# Altium schematic sheet 3V3_REG.SchDoc
size A4; SheetNumber: 2; SheetTotal: 3
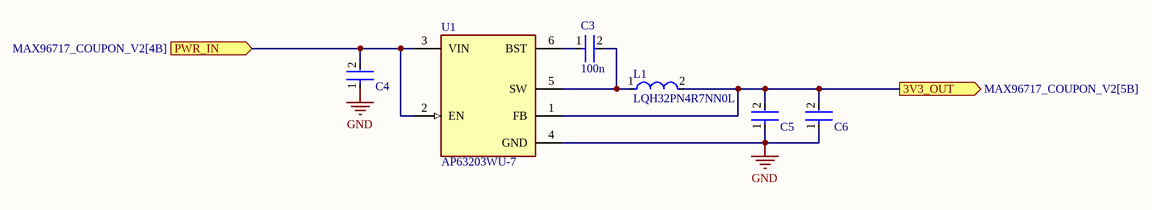
[diagram p0: 3V3_REG.SchDoc]

## Parts
C3  100n  [FP-0402-L_1_0_0_05-W_0_5-IPC_A]
C4  GRM21BR61E226ME44L  [FP-GRM21B-0_2-e0_2_0_7-IPC_B]  (value not drawn)
C5  GRM21BR61E226ME44L  [FP-GRM21B-0_2-e0_2_0_7-IPC_B]  (value not drawn)
C6  GRM21BR61E226ME44L  [FP-GRM21B-0_2-e0_2_0_7-IPC_B]  (value not drawn)
L1  LQH32PN4R7NN0L  [FP-LQH32PB_N0-MFG]
U1  AP63203WU-7  [FP-TSOT26-MFG]

## Ports
3V3_OUT (out, see MAX96717_COUPON_V2[5B]), PWR_IN (in, see MAX96717_COUPON_V2[4B])

## Nets
GND: C4.1 C5.1 C6.1 U1.4(GND)
3V3_OUT: C5.2 C6.2 L1.2 U1.1(FB) ; port 3V3_OUT
PWR_IN: C4.2 U1.2(EN) U1.3(VIN) ; port PWR_IN
NetC3_1: C3.1 U1.6(BST)
NetC3_2: C3.2 L1.1 U1.5(SW)

## Library data of the parts
C3 = CMP-001-00058-1: LARGE PADS, 0402 CAP, CHANGE COMMENT TO MATCH REAL P/N; Capacitor Type: Ceramic; Min Operating Temperature: -55°C; Mounting Technology: Surface Mount; Pins: 2; Case/Package: 0402; RoHS Compliant: Yes; Max Operating Temperature: 85°C
C4-C6 = CMP-2007-03222-3: Chip Multilayer Ceramic Capacitors for General Purpose, 0805, 22uF, X5R, 15%, 20%, 25V; Case/Package: 0805; Depth: 1.25mm; Resistor Type: Ceramic; Voltage Rating: 25V; Lead Free: Lead Free; Voltage Rating (DC): 25V; Case Code (Metric): 2012; Thickness: 0.057inch; REACH SVHC: No SVHC; Material: Ceramic; Tolerance: 20%; Length: 2mm; Capacitance: 22uF; Case Code (Imperial): 0805; Max Operating Temperature: 85°C; Termination: SMD/SMT; Weight: 0.000335oz; Dielectric: X5R; Packaging: Tape and Reel; Voltage: 25V; Package Quantity: 3000; Height: 1.25mm; Mount: Surface Mount; Width: 1.25mm; Min Operating Temperature: -55°C
L1 = CMP-06042-015002-1: Wire Wound Ferrite Inductor for Power Lines 4.7μH ±30% 0.216Ω 1000mA 1210; DC Current: 1A; Self Resonant Frequency: 40MHz; Test Frequency: 1MHz; Inductance: 4.7uH; Shielding: Shielded; DC Resistance (DCR): 180mR; Case/Package: 1210; Lead Free: Lead Free; Inductance Tolerance: 30%; Depth: 2.8mm; Radiation Hardening: No; Case Code (Imperial): 1210; Length: 3.2mm; Height - Seated (Max): 0.067inch; Current Rating: 1A; Max DC Current: 1A; Core Material: Ferrite; Resistor Type: Wirewound; Max Operating Temperature: 85°C; Weight: 0.001552oz; Tolerance: 30%; Width: 0.098inch; Mount: Surface Mount; Height: 2mm; Termination: SMD/SMT; Package Quantity: 2000; Min Operating Temperature: -40°C; Saturation Current: 1A; Packaging: Tape and Reel; Case Code (Metric): 3225; REACH SVHC: No SVHC; Military Standard: Not
U1 = CMP-12757-000006-1: IC REG BUCK 3.3V 2A TSOT26; Manufacturer: Diodes Inc.; Output Type: Fixed; Min Supply Voltage: 3.8V; Number Of Outputs: 1; Max Junction Temp: +160°C; Nominal Supply Current: 22uA; Standoff Height: 0.01mm; Switching Frequency: 1.1MHz; Max Supply Voltage: 32V; ComponentLink2Description: Datasheet; Device Class L1: Integrated Circuits (ICs); Temperature: to +160°C; Device Class L3: Voltage Regulators - Switching; RoHS: TRUE; Octopart: https://octopart.com/ap63203wu-7-diodes+inc.-98099550; Output Voltage: 3.3V; Lead Free: Yes; ComponentLink2URL: https://www.diodes.com/assets/Datasheets/AP63200-AP63201-AP63203-AP63205.pdf; Digikey Description: IC REG BUCK 3.3V 2A TSOT26; Footprint Url: https://www.diodes.com/assets/Package-Files/TSOT26.pdf; Ambient Temperature Range High: +85°C; Height: 1mm; Automotive: No; Temperature Range High: +160°C; Switching Topology: Buck; Output Current: 2A; Package: TSOT26; Category: IC; Mouser Description: AP63203 Series 3.3 V 2 A SMT Fixed Low IQ Synchronous Buck - TSOT-26; Device Class L2: Power Management ICs; Ambient Temperature Range Low: -40°C; Manufacturer Part Number: AP63203WU-7